# Altium project Coffee_printer.PrjPcb (part 1 of 2)
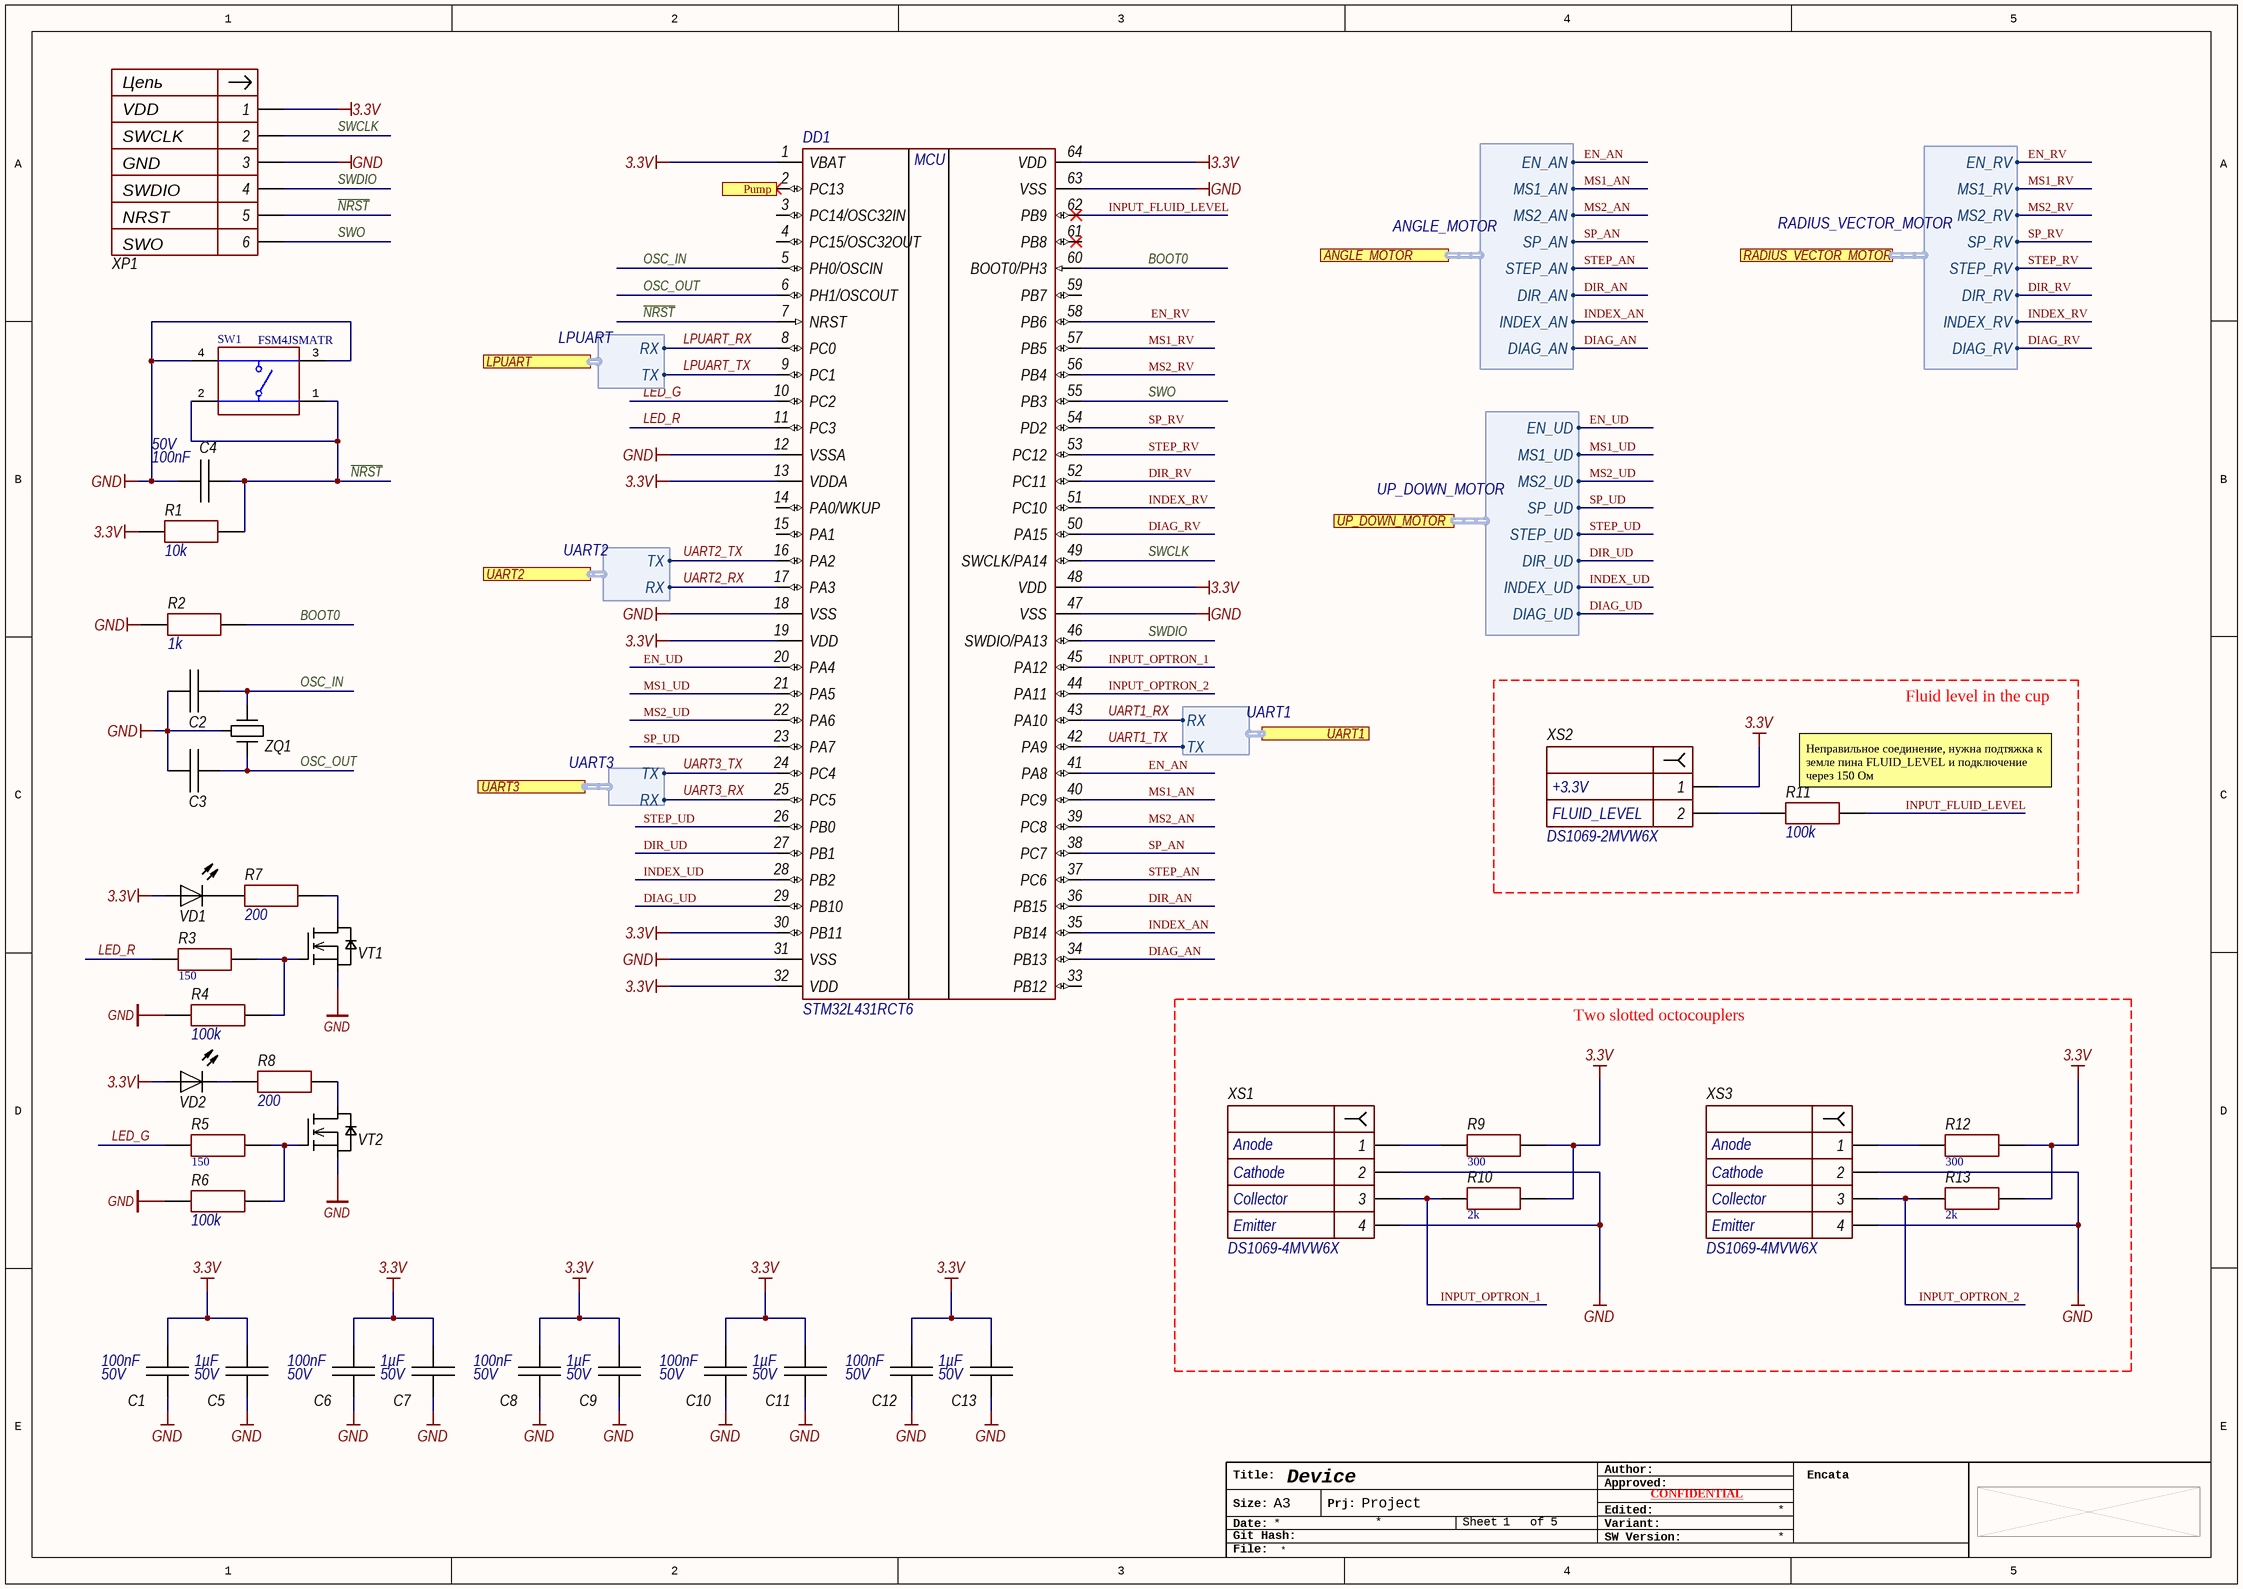
[diagram p0: Coffee_printer MCU.SchDoc]
Organization: Encata; ProjectNumber: 000654321; Title: Device; Title2str: Project
5 sheets, 88 parts. Net scope: flat (ports and power ports of the same name join across sheets).
Board file: Coffee_printer PCB.PcbDoc
Sheets:
  Coffee_printer MCU.SchDoc
  Coffee_printer PWR.SchDoc
  USB-UART.SchDoc
  Drivers_TMC2209.SchDoc
  Pump.SchDoc

## Sheet Coffee_printer MCU.SchDoc: Device
size 420 x 297 mm; SheetNumber: 1; SheetTotal: 5; ProjectTitle: Prj name

### Parts
C1  Capacitance: 100nF  Voltage Rating: 50V  [CAPC0603_H0.90_N]  (hidden comment: CC0603KRX7R7BB104)
C2  18  [CAPC0603_H0.85_N]  (value not drawn)
C3  18  [CAPC0603_H0.85_N]  (value not drawn)
C4  Capacitance: 100nF  Voltage Rating: 50V  [CAPC0603_H0.90_N]  (hidden comment: CC0603KRX7R7BB104)
C5  Voltage Rating: 50V  Capacitance: 1µF  [CAPC0603_H0.90_N]  (hidden comment: CC0603KRX7R7BB105)
C6  Capacitance: 100nF  Voltage Rating: 50V  [CAPC0603_H0.90_N]  (hidden comment: CC0603KRX7R7BB104)
C7  Voltage Rating: 50V  Capacitance: 1µF  [CAPC0603_H0.90_N]  (hidden comment: CC0603KRX7R7BB105)
C8  Capacitance: 100nF  Voltage Rating: 50V  [CAPC0603_H0.90_N]  (hidden comment: CC0603KRX7R7BB104)
C9  Voltage Rating: 50V  Capacitance: 1µF  [CAPC0603_H0.90_N]  (hidden comment: CC0603KRX7R7BB105)
C10  Capacitance: 100nF  Voltage Rating: 50V  [CAPC0603_H0.90_N]  (hidden comment: CC0603KRX7R7BB104)
C11  Voltage Rating: 50V  Capacitance: 1µF  [CAPC0603_H0.90_N]  (hidden comment: CC0603KRX7R7BB105)
C12  Capacitance: 100nF  Voltage Rating: 50V  [CAPC0603_H0.90_N]  (hidden comment: CC0603KRX7R7BB104)
C13  Voltage Rating: 50V  Capacitance: 1µF  [CAPC0603_H0.90_N]  (hidden comment: CC0603KRX7R7BB105)
DD1  STM32L431RCT6  [LQFP-64]
R1  Resistance: 10k  [RESC0603_N]  (hidden comment: RC0603FR-0710KL)
R2  Resistance: 1k  [RESC0603_N]  (hidden comment: RC0603FR-071KL)
R3  Resistance: 150  [RESC0603_N]  (hidden comment: RC0603FR-07150RL)
R4  Resistance: 100k  [RESC0603_N]  (hidden comment: RC0603FR-07100KL)
R5  Resistance: 150  [RESC0603_N]  (hidden comment: RC0603FR-07150RL)
R6  Resistance: 100k  [RESC0603_N]  (hidden comment: RC0603FR-07100KL)
R7  Resistance: 200  [RESC0603_N]  (hidden comment: RC0603FR-07200RL)
R8  Resistance: 200  [RESC0603_N]  (hidden comment: RC0603FR-07200RL)
R9  Resistance: 300  [RESC0603_N]  (hidden comment: RC0603FR-07300RL)
R10  Resistance: 2k  [RESC0603_N]  (hidden comment: RC0603FR-072KL)
R11  Resistance: 100k  [RESC0603_N]  (hidden comment: RC0603FR-07100KL)
R12  Resistance: 300  [RESC0603_N]  (hidden comment: RC0603FR-07300RL)
R13  Resistance: 2k  [RESC0603_N]  (hidden comment: RC0603FR-072KL)
SW1  FSM4JSMATR  [TECO-FSM4JSMATR_V]
VD1  FYLS-0603URC  [CH0603LR]  (value not drawn)
VD2  FYLS-0603UGC  [CH0603LG]  (value not drawn)
VT1  MMBF170LT1G  [SOT-23-3]  (value not drawn)
VT2  MMBF170LT1G  [SOT-23-3]  (value not drawn)
XP1  STM32_6pin_SWD  [PLS-6(DS-1021-1x6)]  (value not drawn)
XS1  DS1069-4MVW6X  NET4: Emitter  NET3: Collector  NET2: Cathode  NET1: Anode  [CWF-4]
XS2  DS1069-2MVW6X  NET2: FLUID_LEVEL  NET1: +3.3V  [CWF-2]
XS3  DS1069-4MVW6X  NET4: Emitter  NET3: Collector  NET2: Cathode  NET1: Anode  [CWF-4]
ZQ1  ABM3B-8.000MHZ-B2-T  [ZQ_ABM3B-B2-T]  (value not drawn)

### Blocks framed on the sheet
Fluid level in the cup: R11 XS2
Two slotted octocouplers: R9 R10 R12 R13 XS1 XS3

### Ports
ANGLE_MOTOR (harness ANGLE_MOTOR), LPUART (harness LPUART), Pump (in), RADIUS_VECTOR_MOTOR (harness RADIUS_VECTOR_MOTOR), UART1 (harness UART1), UART2 (harness UART2), UART3 (harness UART3), UP_DOWN_MOTOR (harness UP_DOWN_MOTOR)

### Harnesses
UART2: RX, TX
UART1: RX, TX
UART3: RX, TX
LPUART: TX, RX
ANGLE_MOTOR: MS1_AN, EN_AN, MS2_AN, SP_AN, STEP_AN, DIR_AN, INDEX_AN, DIAG_AN
RADIUS_VECTOR_MOTOR: MS1_RV, EN_RV, MS2_RV, SP_RV, STEP_RV, DIR_RV, INDEX_RV, DIAG_RV
UP_DOWN_MOTOR: MS1_UD, EN_UD, MS2_UD, SP_UD, STEP_UD, DIR_UD, INDEX_UD, DIAG_UD

### Nets
3.3V: C1.1 C5.1 C6.1 C7.1 C8.1 C9.1 C10.1 C11.1 C12.1 C13.1 DD1.1(VBAT) DD1.13(VDDA) DD1.19(VDD) DD1.30(PB11) DD1.32(VDD) DD1.48(VDD) DD1.64(VDD) R1.1 R9.2 R10.2 R12.2 R13.2 VD1.1 VD2.1 XP1.1 XS2.1
GND: C1.2 C2.1 C3.1 C4.1 C5.2 C6.2 C7.2 C8.2 C9.2 C10.2 C11.2 C12.2 C13.2 DD1.12(VSSA) DD1.18(VSS) DD1.31(VSS) DD1.47(VSS) DD1.63(VSS) R2.1 R4.1 R6.2 SW1.3 SW1.4 VT1.2(S) VT2.2(S) XP1.3 XS1.2 XS1.4 XS3.2 XS3.4 ZQ1.2
BOOT0: DD1.60(BOOT0/PH3) R2.2
DIAG_AN: DD1.34(PB13) ; port ANGLE_MOTOR.DIAG_AN
DIAG_RV: DD1.50(PA15) ; port RADIUS_VECTOR_MOTOR.DIAG_RV
DIAG_UD: DD1.29(PB10) ; port UP_DOWN_MOTOR.DIAG_UD
DIR_AN: DD1.36(PB15) ; port ANGLE_MOTOR.DIR_AN
DIR_RV: DD1.52(PC11) ; port RADIUS_VECTOR_MOTOR.DIR_RV
DIR_UD: DD1.27(PB1) ; port UP_DOWN_MOTOR.DIR_UD
EN_AN: DD1.41(PA8) ; port ANGLE_MOTOR.EN_AN
EN_RV: DD1.58(PB6) ; port RADIUS_VECTOR_MOTOR.EN_RV
EN_UD: DD1.20(PA4) ; port UP_DOWN_MOTOR.EN_UD
INDEX_AN: DD1.35(PB14) ; port ANGLE_MOTOR.INDEX_AN
INDEX_RV: DD1.51(PC10) ; port RADIUS_VECTOR_MOTOR.INDEX_RV
INDEX_UD: DD1.28(PB2) ; port UP_DOWN_MOTOR.INDEX_UD
INPUT_FLUID_LEVEL: DD1.62(PB9) R11.1
INPUT_OPTRON_1: DD1.45(PA12) R10.1 XS1.3
INPUT_OPTRON_2: DD1.44(PA11) R13.1 XS3.3
LED_G: DD1.10(PC2) R5.1
LED_R: DD1.11(PC3) R3.1
LPUART_RX: DD1.8(PC0) ; port LPUART.RX
LPUART_TX: DD1.9(PC1) ; port LPUART.TX
MS1_AN: DD1.40(PC9) ; port ANGLE_MOTOR.MS1_AN
MS1_RV: DD1.57(PB5) ; port RADIUS_VECTOR_MOTOR.MS1_RV
MS1_UD: DD1.21(PA5) ; port UP_DOWN_MOTOR.MS1_UD
MS2_AN: DD1.39(PC8) ; port ANGLE_MOTOR.MS2_AN
MS2_RV: DD1.56(PB4) ; port RADIUS_VECTOR_MOTOR.MS2_RV
MS2_UD: DD1.22(PA6) ; port UP_DOWN_MOTOR.MS2_UD
~{NRST}: C4.2 DD1.7(NRST) R1.2 SW1.1 SW1.2 XP1.5
OSC_IN: C2.2 DD1.5(PH0/OSCIN) ZQ1.1
OSC_OUT: C3.2 DD1.6(PH1/OSCOUT) ZQ1.3
SP_AN: DD1.38(PC7) ; port ANGLE_MOTOR.SP_AN
SP_RV: DD1.54(PD2) ; port RADIUS_VECTOR_MOTOR.SP_RV
SP_UD: DD1.23(PA7) ; port UP_DOWN_MOTOR.SP_UD
STEP_AN: DD1.37(PC6) ; port ANGLE_MOTOR.STEP_AN
STEP_RV: DD1.53(PC12) ; port RADIUS_VECTOR_MOTOR.STEP_RV
STEP_UD: DD1.26(PB0) ; port UP_DOWN_MOTOR.STEP_UD
SWCLK: DD1.49(SWCLK/PA14) XP1.2
SWDIO: DD1.46(SWDIO/PA13) XP1.4
SWO: DD1.55(PB3) XP1.6
UART1_RX: DD1.43(PA10) ; port UART1.RX
UART1_TX: DD1.42(PA9) ; port UART1.TX
UART2_RX: DD1.17(PA3) ; port UART2.RX
UART2_TX: DD1.16(PA2) ; port UART2.TX
UART3_RX: DD1.25(PC5) ; port UART3.RX
UART3_TX: DD1.24(PC4) ; port UART3.TX
NetDD1_2: DD1.2(PC13) ; port Pump
NetR3_2: R3.2 R4.2 VT1.1(G)
NetR5_2: R5.2 R6.1 VT2.1(G)
NetR7_1: R7.1 VD1.2
NetR7_2: R7.2 VT1.3(D)
NetR8_1: R8.1 VD2.2
NetR8_2: R8.2 VT2.3(D)
NetR9_1: R9.1 XS1.1
NetR11_2: R11.2 XS2.2
NetR12_1: R12.1 XS3.1

Not connected (* = marked no-connect by the designer): DD1 3(PC14/OSC32IN) 4(PC15/OSC32OUT) 14(PA0/WKUP) 15(PA1) 33(PB12) 59(PB7) 61(PB8)

### Notes on the sheet
- (near R11) Неправильное соединение, нужна подтяжка к земле пина FLUID_LEVEL и подключение через 150 Ом
- Title:
- Author:
- Approved:
- Size:
- Date:
- Git Hash:
- A3
- Prj:
- Sheet
- of
- SW Version:
- Variant:
- Edited:
- CONFIDENTIAL
- File:
- (in symbol CMP-CON-B2B-0103-4) Цепь; VDD; SWCLK; GND; SWDIO; NRST; SWO
- (in symbol CMP-IC-EMBEDDED-MCU-0000-3) MCU

### Library data of the parts
C1 C4 C6 C8 C10 C12 = CMP-CAP-CER-SMD-0036-1: 0.1uF 10% X7R 50V 0603; Manufacturer: Yageo; Length: 1.6mm; Min Operating Temperature: -55°C; Case Code (Metric): 1608; Case Code (Imperial): 0603; Author: v.ivanchenko; Tolerance: 10%; Case/Package: 0603; Depth: 800µm; Manufacturer Part Number: CC0603KRX7R7BB104; HelpURL: https://www.yageo.com/upload/media/product/products/datasheet/mlcc/UPY-GPHC_X7R_6.3V-to-50V_20.pdf; Max Operating Temperature: 125°C; Lead Free: Lead Free; Height: 800µm; Dielectric: X7R; Series: CC
C2 C3 = CC0603FRNPO9BN180_Yageo: CAPC 18PF 50V C0G/NPO SMD 0603; Manufacturer: Yageo; Tolerance: ± 5 %; Voltage: 50 В; TKE: C0G; ValueBOM: Конденсатор CC0603FRNPO9BN180 "Yageo" (18 пФ ± 5 %, 50 В, C0G, SMD 0603); Автор: Жегалов Сергей; Количество1: 1; Цена1: 0.0348; Количество2: 4000; Цена2: 0.0268; Разрешен к применению: True; Type_BOM: Конденсатор; PartNumber: CC0603FRNPO9BN180_Yageo; HelpURL: http://www.yageo.com/documents/recent/UPY-GP_NP0_16V-to-50V_16.pdf; ManufacturerPartNumber: CC0603FRNPO9BN180; ComponentLink3Description: Datasheet; Value: 18; ComponentLink2Description: Manufacturer Link; ComponentLink2URL: http://www.yageo.com/; Operating Temperature: -55°C ~ +125°C; Modify: 15.11.2018 9:22:46; Supplier: Compel; Supplier P/N: CC0603FRNPO9BN180; Sorting: 18; Package Description: SMD 0603 H0.85mm; ComponentLink4URL: https://sds.compel.ru/search?q=CC0603FRNPO9BN180; ComponentLink5URL: https://www.chipdip.by/search?searchtext=CC0603FRNPO9BN180; ComponentLink6URL: https://belchip.by/search_fuzzy/?query=CC0603FRNPO9BN180; ComponentLink4Description: Compel; ComponentLink5Description: Chip-Dip; ComponentLink6Description: Belchip; Package: CAPC0603; Package_BOM: SMD 0603
C5 C7 C9 C11 C13 = CMP-CAP-CER-SMD-0035-1: 1uF 10% X7R 50V 0603; Manufacturer: Yageo; HelpURL: https://www.yageo.com/upload/media/product/products/datasheet/mlcc/UPY-GPHC_X7R_6.3V-to-50V_20.pdf; Series: CC; Min Operating Temperature: -55°C; Tolerance: 10%; Case Code (Imperial): 0603; Manufacturer Part Number: CC0603KRX7R7BB105; Max Operating Temperature: 125°C; Case/Package: 0603; Depth: 800µm; Length: 1.6mm; Height: 800µm; Case Code (Metric): 1608; Lead Free: Lead Free; Dielectric: X7R; Author: v.ivanchenko
DD1 = CMP-IC-EMBEDDED-MCU-0000-3: MCU 32-Bit STM32 ARM Cortex M4 RISC 256KB Flash 1.8V/2.5V/3.3V 64-Pin LQFP; Manufacturer: ST; Core Architecture: ARM Cortex-M4; Number of Timers/Counters: 1; Number of ADC Channels: 16; Number of D/A Converters: 2; RAM Size: 64; Frequency: 80MHz; Min Supply Voltage: 1.62V; Number of UART Channels: 4; Interface: CAN, I2C, IrDA, LIN, SPI, USART; Max Supply Voltage: 3.6V; Number of USART Channels: 3; Number of PWM Channels: 11; Number of I/Os: 52; Manufacturer Part Number: STM32L431RCT6; Author: a.antipov; Case/Package: LQFP-64; Min Operating Temperature: -40°C; Number of A/D Converters: 1; Number of Pins: 64; Mount: Surface mount; Max Operating Temperature: 85°C; HelpUrl: https://www.st.com/resource/en/datasheet/stm32l431rc.pdf; Number of I2C Channels: 3; Number of SPI Channels: 3; Flash Memory Size: 256kB
R1 = CMP-RES-SMD-0437-2: RES SMD 10 KOHM 1% 1/10W 0603; Manufacturer: Yageo; Max Power Dissipation: 100mW; Temperature Coefficient: ±100ppm/C°; Voltage Rating: 75V; Author: M.S. Koval; Case/Package: 0603; HelpURL: https://www.yageo.com/upload/media/product/productsearch/datasheet/rchip/PYu-RC_Group_51_RoHS_L_11.pdf; Manufacturer Part Number: RC0603FR-0710KL; Max Operating Temperature: 155°C; Min Operating Temperature: -55°C; Tolerance: 1%
R2 = CMP-RES-SMD-0413-2: RES SMD 1 KOHM 1% 1/10W 0603; Manufacturer: Yageo; Max Power Dissipation: 100mW; Temperature Coefficient: ±100ppm/C°; Voltage Rating: 75V; Author: M.S. Koval; Case/Package: 0603; HelpURL: https://www.yageo.com/upload/media/product/productsearch/datasheet/rchip/PYu-RC_Group_51_RoHS_L_11.pdf; Manufacturer Part Number: RC0603FR-071KL; Max Operating Temperature: 155°C; Min Operating Temperature: -55°C; Tolerance: 1%
R3 R5 = CMP-RES-SMD-0393-5: RES SMD 150 OHM 1% 1/10W 0603; Manufacturer: Yageo; Max Power Dissipation: 100mW; Temperature Coefficient: ±100ppm/C°; Voltage Rating: 75V; Author: M.S. Koval; Case/Package: 0603; HelpURL: https://www.yageo.com/upload/media/product/productsearch/datasheet/rchip/PYu-RC_Group_51_RoHS_L_11.pdf; Manufacturer Part Number: RC0603FR-07150RL; Max Operating Temperature: 155°C; Min Operating Temperature: -55°C; Tolerance: 1%
R4 R6 R11 = CMP-RES-SMD-0462-2: RES SMD 100 KOHM 1% 1/10W 0603; Manufacturer: Yageo; Max Power Dissipation: 100mW; Temperature Coefficient: ±100ppm/C°; Voltage Rating: 75V; Author: M.S. Koval; Case/Package: 0603; HelpURL: https://www.yageo.com/upload/media/product/productsearch/datasheet/rchip/PYu-RC_Group_51_RoHS_L_11.pdf; Manufacturer Part Number: RC0603FR-07100KL; Max Operating Temperature: 155°C; Min Operating Temperature: -55°C; Tolerance: 1%
R7 R8 = CMP-RES-SMD-0396-2: RES SMD 200 OHM 1% 1/10W 0603; Manufacturer: Yageo; Max Power Dissipation: 100mW; Temperature Coefficient: ±100ppm/C°; Voltage Rating: 75V; Author: M.S. Koval; Case/Package: 0603; HelpURL: https://www.yageo.com/upload/media/product/productsearch/datasheet/rchip/PYu-RC_Group_51_RoHS_L_11.pdf; Manufacturer Part Number: RC0603FR-07200RL; Max Operating Temperature: 155°C; Min Operating Temperature: -55°C; Tolerance: 1%
R9 R12 = CMP-RES-SMD-0400-5: RES SMD 300 OHM 1% 1/10W 0603; Manufacturer: Yageo; Voltage Rating: 75V; Temperature Coefficient: ±100ppm/C°; Max Power Dissipation: 100mW; Max Operating Temperature: 155°C; Tolerance: 1%; HelpURL: https://www.yageo.com/upload/media/product/productsearch/datasheet/rchip/PYu-RC_Group_51_RoHS_L_11.pdf; Min Operating Temperature: -55°C; Case/Package: 0603; Author: M.S. Koval; Manufacturer Part Number: RC0603FR-07300RL
R10 R13 = CMP-RES-SMD-0420-5: RES SMD 2 KOHM 1% 1/10W 0603; Manufacturer: Yageo; Max Power Dissipation: 100mW; Temperature Coefficient: ±100ppm/C°; Voltage Rating: 75V; Author: M.S. Koval; Case/Package: 0603; HelpURL: https://www.yageo.com/upload/media/product/productsearch/datasheet/rchip/PYu-RC_Group_51_RoHS_L_11.pdf; Manufacturer Part Number: RC0603FR-072KL; Max Operating Temperature: 155°C; Min Operating Temperature: -55°C; Tolerance: 1%
SW1 = CMP-2000-07486-1: Micro Miniature Push Button Switch FSM JSM, 50 mA, -35 to 85 degC, 4-Pin SMD, RoHS, Tape and Reel; Manufacturer: TE Connectivity; Mechanical Life: 100000Cycles; Current Rating: 50mA; Actuator Material: Polyamide; Max Voltage Rating (DC): 12V; Capacitance: 0f; Illumination Type: Illuminated; Voltage Rating (DC): 24V; Case\/Package: SMD/SMT; Operating Force: 160gf; Contact Resistance: 100mOhm; Actuator Length: 0.055inch; Switch Travel: 0.25mm; Throw Configuration: SPST; Termination: GullWing; Contact Plating: Silver; Orientation: Straight; Mounting Technology: SurfaceMount; REACH SVHC: Unknown; Electrical Life: 100000Cycles; Package Reference: FSM4JSMATR; Max Operating Temperature: 85degC; Manufacturer URL: http://www.te.com/; Package Description: 4-Pin Surface Mount Device, Body 6 x 6 mm, Pitch 4.5 mm; Datasheet Version: Rev. V, 02/2015; Packaging: TapeandReel; Min Operating Temperature: -35degC; Mount: SurfaceMount; Contact Current Rating: 50mA; Contact Material: CopperAlloy; Package Quantity: 1200; Datasheet URL: http://www.te.com/commerce/DocumentDelivery/DDEController?Action=showdoc&DocId=Customer+Drawing%7F2-1437565-7%7FV%7Fpdf%7FEnglish%7FENG_CD_2-1437565-7_V.pdf%7F4-1437565-2; RoHSCompliant: true
VD1 = FYLS-0603URC_Foryard Optoelectronics: VD FYLS-0603URC LED RED 20mA 2,1V SMD 0603; ValueBOM: Диод FYLS-0603URC "Foryard Optoelectronics" CH0603; Voltage: 2,1 В; Автор: Коваль Максим; Количество1: 1; Цена1: 0.0450; Количество2: 16000; Цена2: 0.0306; Разрешен к применению: True; ВП: Диод FYLS-0603URC CH0603; Package_BOM: CH0603; Type_BOM: Диод; PartNumber: FYLS-0603URC_Foryard Optoelectronics; HelpURL: http://www.foryard-led.ru/pdf/fyls-0603urc.pdf; ManufacturerPartNumber: FYLS-0603URC; Manufacturer: Foryard Optoelectronics; ComponentLink3Description: Datasheet; Value: FYLS-0603URC; ComponentLink2Description: Manufacturer Link; ComponentLink2URL: http://foryard.com; Operating Temperature: -40°C ~ +85°C; Modify: 14.01.2019 13:57:40; Supplier: Compel; Supplier P/N: FYLS-0603URC; Package Description: LED 0603 RED; ComponentLink4URL: https://sds.compel.ru/search?q=FYLS-0603URC; ComponentLink5URL: https://www.chipdip.by/search?searchtext=FYLS-0603URC; ComponentLink6URL: https://belchip.by/search_fuzzy/?query=FYLS-0603URC; ComponentLink4Description: Compel; ComponentLink5Description: Chip-Dip; ComponentLink6Description: Belchip
VD2 = FYLS-0603UGC_Foryard Optoelectronics: VD FYLS-0603UGC LED GREEN 20mA 2V SMD 0603; ValueBOM: Диод FYLS-0603UGC "Foryard Optoelectronics" CH0603; Voltage: 2 В; Автор: Коваль Максим; Количество1: 1; Цена1: 0.0450; Количество2: 16000; Цена2: 0.0306; Разрешен к применению: True; ВП: Диод FYLS-0603UGC CH0603; Package_BOM: CH0603; Type_BOM: Диод; PartNumber: FYLS-0603UGC_Foryard Optoelectronics; HelpURL: http://www.foryard-led.ru/pdf/fyls-0603ugc.pdf; ManufacturerPartNumber: FYLS-0603UGC; Manufacturer: Foryard Optoelectronics; ComponentLink3Description: Datasheet; Value: FYLS-0603UGC; ComponentLink2Description: Manufacturer Link; ComponentLink2URL: http://foryard.com; Operating Temperature: -40°C ~ +85°C; Modify: 14.01.2019 13:57:40; Supplier: Compel; Supplier P/N: FYLS-0603UGC; Package Description: LED 0603 GREEN; ComponentLink4URL: https://sds.compel.ru/search?q=FYLS-0603UGC; ComponentLink5URL: https://www.chipdip.by/search?searchtext=FYLS-0603UGC; ComponentLink6URL: https://belchip.by/search_fuzzy/?query=FYLS-0603UGC; ComponentLink4Description: Compel; ComponentLink5Description: Chip-Dip; ComponentLink6Description: Belchip
VT1 VT2 = CMP-DISCRETE-TRANSISTORS-MOSFET0002-1: MMBF170L: Small Signal MOSFET 60V 500mA 5 Ohm Single N-Channel SOT-23 Logic Level; Manufacturer: ON Semiconductor; Type: N-ch; Power Dissipation: 225mW; Input Capacitance: 60pF; Theshold Voltage Vgth: 3V; Rds ON Max: 5; Gate to source voltage: 20V; Drain to Source Voltage Vds: 60V; Mount: Surface mount; Manufacturer Part Number: MMBF170LT1G; HelpUrl: https://www.onsemi.com/pdf/datasheet/mmbf170lt1-d.pdf; Continuous Drain Current ID: 500mA; Author: m.seliadtsou
XP1 = CMP-CON-B2B-0103-4: Manufacturer: FOXCONN; Manufacturer Part Number: HB3106F; Contact Current Rating: 2A; Gender: Male; Number of Contacts: 6; Pitch: 2.54mm; Voltage Rating: 60V; Author: v.taranau; Contact Gender: Male Headers; HelpURL: https://datasheet.lcsc.com/lcsc/2103291806_FOXCONN-HB3106F_C2761399.pdf; Mount: Through Hole
XS1 XS3 = CMP-CON-B2B-0011-2: 2.5mm, 4 pin, Male, 3A, Vertical mounting, CONNFLY; Gender: Female; Number of Contacts: 4; Voltage Rating: 250V; Author: a.antipov; Color: White; Contact Current Rating: 3A; Contact Gender: Male; Contact Plating: Tin; HelpURL: http://outer.connfly.group/static/upload/file/pdf/DS1069.pdf; Manufacturer: CONNFLY; Manufacturer Part Number: DS1069-4MVW6X; Mount: Through Hole; Orientation: Vertical; Pitch: 2.5mm
XS2 = CMP-CON-B2B-0007-3: 2.5mm, 2 pin, Male, 3A, Vertical mounting, CONNFLY; Gender: Female; Number of Contacts: 2; Voltage Rating: 250V; Author: a.antipov; Color: White; Contact Current Rating: 3A; Contact Gender: Male; Contact Plating: Tin; HelpURL: http://outer.connfly.group/static/upload/file/pdf/DS1069.pdf; Manufacturer: CONNFLY; Manufacturer Part Number: DS1069-2MVW6X; Mount: Through Hole; Orientation: Vertical; Pitch: 2.5mm
ZQ1 = ABM3B-8.000MHZ-B2-T_Abracon LLC: ZQ ABM3B-8.000MHZ-B2-T CERAMIC SMD CRYSTAL 8 MHz; ValueBOM: Кварцевый резонатор ABM3B-8.000MHZ-B2-T "Abracon LLC"; Автор: Касперович Андрей; Количество1: 1; Цена1: 0.4; Количество2: 10000; Цена2: 0.266; Разрешен к применению: True; ВП: Кварцевый резонатор ABM3B-8.000MHZ-B2-T; Type_BOM: Разное; HelpURL: https://ru.mouser.com/datasheet/2/3/abm3b-39910.pdf; PartNumber: ABM3B-8.000MHZ-B2-T_Abracon LLC; ManufacturerPartNumber: ABM3B-8.000MHZ-B2-T; Manufacturer: Abracon LLC; Value: ABM3B-8.000MHZ-B2-T; ComponentLink3Description: Datasheet; Modify: 16.11.2018 10:44:09; Supplier: Compel; Supplier P/N: ABM3B-8.000MHZ-B2-T; Package: ZQ_ABM3B-B2-T; ComponentLink4URL: https://sds.compel.ru/search?q=ABM3B-8.000MHZ-B2-T; ComponentLink5URL: https://www.chipdip.by/search?searchtext=ABM3B-8.000MHZ-B2-T; ComponentLink6URL: https://belchip.by/search_fuzzy/?query=ABM3B-8.000MHZ-B2-T; ComponentLink4Description: Compel; ComponentLink5Description: Chip-Dip; ComponentLink6Description: Belchip; Package_BOM: ZQ_ABM3B-B2-T; Package Description: ZQ_ABM3B-B2-T; SMD mounting: True; ComponentLink1Description: Supplier; ComponentLink1URL: http://www.compel.ru; ComponentLink2Description: Manufacturer Link; ComponentLink2URL: http://www.abracon.com; Type: XXX

## Sheet Coffee_printer PWR.SchDoc: Device
size 420 x 297 mm; SheetNumber: 2; SheetTotal: 5; ProjectTitle: Prj name
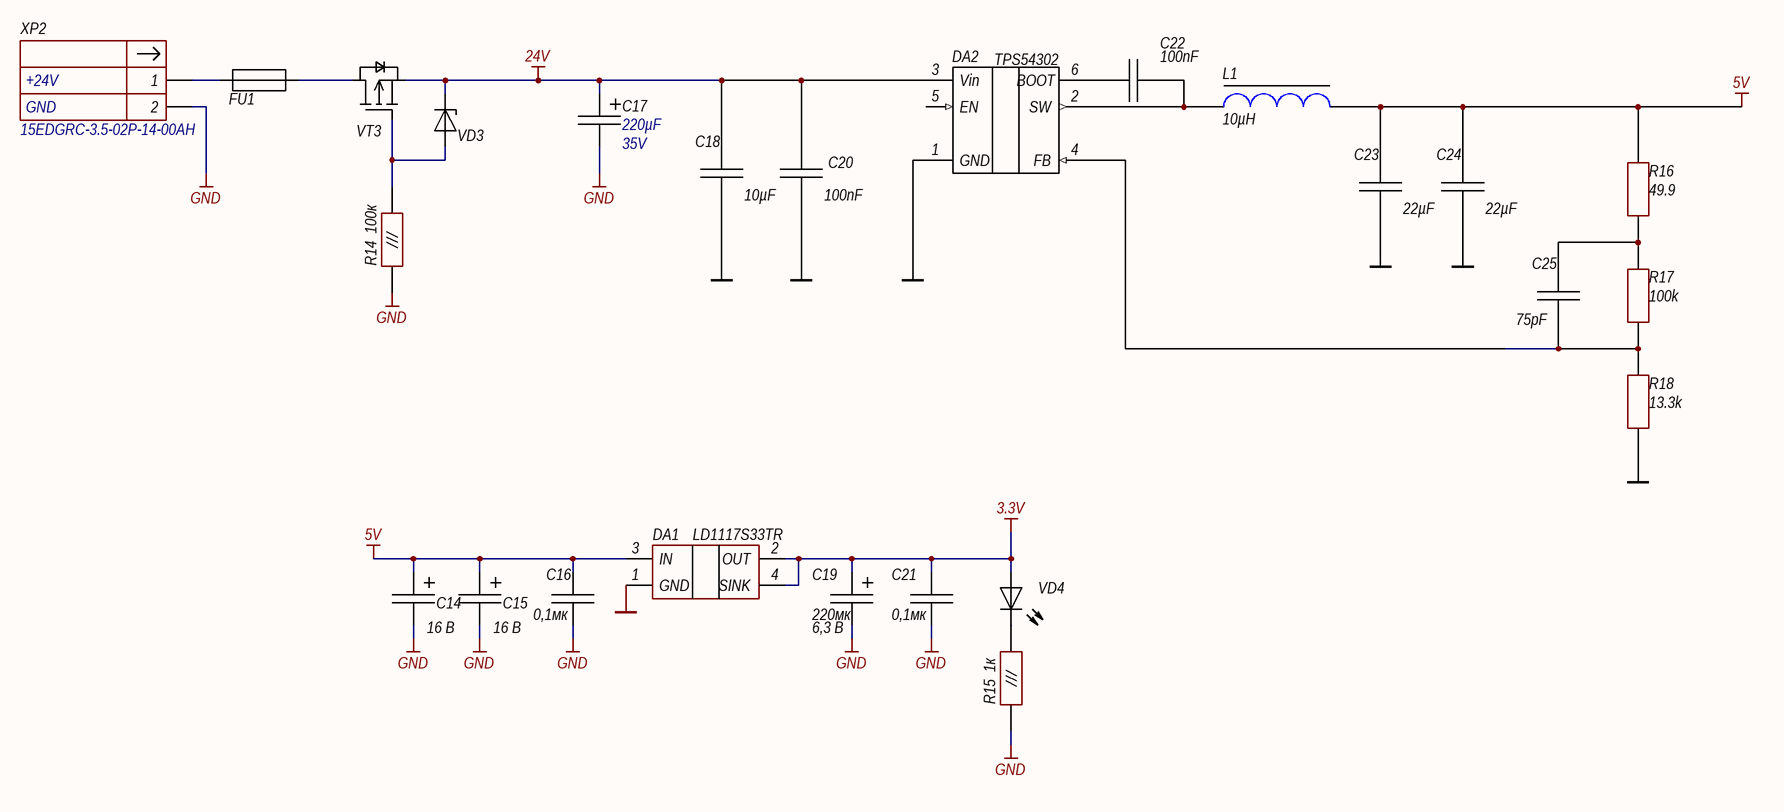
[diagram p1: Coffee_printer PWR.SchDoc]

### Parts
C14  voltage: 16 В  [CAPELSMD_D6.3_H5.5]  (hidden comment: 100мк)
C15  voltage: 16 В  [CAPELSMD_D6.3_H5.5]  (hidden comment: 100мк)
C16  0,1мк  [CAPC0805_H1.0_N]
C17  Capacitance: 220µF  Voltage Rating: 35V  [CAPELSMD_D8_H10.2]  (hidden comment: EEEFK1V221P)
C18  Capacitance: 10µF  [CAPC1210_H2.2_N]  (hidden comment: CL32B106KBJNFNE)
C19  220мк  voltage: 6,3 В  [CAPTAN_C_N]
C20  Capacitance: 100nF  [CAPC0603_H0.90_N]  (hidden comment: CC0603KRX7R7BB104)
C21  0,1мк  [CAPC0805_H1.0_N]
C22  Capacitance: 100nF  [CAPC0603_H0.90_N]  (hidden comment: CC0603KRX7R7BB104)
C23  Capacitance: 22µF  [CAPC1210_H2.2_N]  (hidden comment: CL32B226KAJNNNE)
C24  Capacitance: 22µF  [CAPC1210_H2.2_N]  (hidden comment: CL32B226KAJNNNE)
C25  Capacitance: 75pF  [CAPC0603_H0.90_N]  (hidden comment: CC0603JRNPO9BN750)
DA1  LD1117S33TR  [SOT-223]
DA2  TPS54302  [SOT-23-6]
FU1  0451001.MRL  [SMT_FUSE_451_453]  (value not drawn)
L1  Inductance: 10µH  [IHLP2525]  (hidden comment: IHLP2525CZER100M11)
R14  100к  [RESC0603_N]
R15  1к  [RESC0603_N]
R16  Resistance: 49.9  [RESC0603_N]  (hidden comment: RC0603FR-0749R9L)
R17  Resistance: 100k  [RESC0603_N]  (hidden comment: RC0603FR-07100KL)
R18  Resistance: 13.3k  [RESC0603_N]  (hidden comment: RC0603FR-0713K3L)
VD3  MMSZ12T1G  [SOD-123]  (value not drawn)
VD4  FYLS-0603UGC  [CH0603LG]  (value not drawn)
VT3  SI7617DN-T1-GE3  [PowerPAK 1212-8]  (value not drawn)
XP2  15EDGRC-3.5-02P-14-00AH  NET1: +24V  NET2: GND  [15EDGRC-3.5-02P-14-00AH]

### Nets
3.3V: C19.1 C21.1 DA1.2(OUT) DA1.4(SINK) VD4.1
5V: C14.1 C15.1 C16.1 C23.1 C24.1 DA1.3(IN) L1.2 R16.2
24V: C17.1 C18.1 C20.2 DA2.3(Vin) VD3.2 VT3.2(S)
GND: C14.2 C15.2 C16.2 C17.2 C18.2 C19.2 C20.1 C21.2 C23.2 C24.2 DA1.1(GND) DA2.1(GND) R14.1 R15.1 R18.1 XP2.2
NetC22_1: C22.1 DA2.6(BOOT)
NetC22_2: C22.2 DA2.2(SW) L1.1
NetC25_1: C25.1 R16.1 R17.2
NetC25_2: C25.2 DA2.4(FB) R17.1 R18.2
NetFU1_1: FU1.1 XP2.1
NetFU1_2: FU1.2 VT3.3(D)
NetR14_2: R14.2 VD3.1 VT3.1(G)
NetR15_2: R15.2 VD4.2

Not connected (* = marked no-connect by the designer): DA2 5(EN)

### Notes on the sheet
- Title:
- Author:
- Approved:
- Size:
- Date:
- Git Hash:
- A3
- Prj:
- Sheet
- of
- SW Version:
- Variant:
- Edited:
- CONFIDENTIAL
- File:

### Library data of the parts
C14 C15 = CA016M0100RED-0605_Yageo: CAP ALUM 100UF 20% 16V SMD; Manufacturer: Yageo; ValueBOM: Конденсатор CA016M0100RED-0605 "Yageo" (100 мкФ ± 20 %, 16 В SMD_D6.3_H5.5); Marking: 100 16V; Sorting: 100000000; Автор: Жегалов Сергей; Количество1: 1; Цена1: 0.0496; Количество2: 5000; Цена2: 0.0354; Разрешен к применению: True; Package_BOM: SMD_D6.3_H5.5; Type_BOM: Конденсатор; PartNumber: CA016M0100RED-0605_Yageo; HelpURL: http://www.yageo.com/documents/recent/E-Cap_SurfaceMount_CA_2011.pdf; ManufacturerPartNumber: CA016M0100RED-0605; ComponentLink3Description: Datasheet; Value: 100мк; Tolerance: ± 20 %; ComponentLink2Description: Manufacturer Link; ComponentLink2URL: http://www.yageo.com/; Operating Temperature: -40°C ~ +85°C; Modify: 19.11.2018 13:30:41; Supplier: Compel; Supplier P/N: CA016M0100RED-0605; Package Description: SMD D6.3mm, H5.5mm; ComponentLink4URL: https://sds.compel.ru/search?q=CA016M0100RED-0605; ComponentLink5URL: https://www.chipdip.by/search?searchtext=CA016M0100RED-0605; ComponentLink6URL: https://belchip.by/search_fuzzy/?query=CA016M0100RED-0605; ComponentLink4Description: Compel; ComponentLink5Description: Chip-Dip; ComponentLink6Description: Belchip; Package: CAPELSMD_D6.3_H5.5
C16 C21 = CC0805KPX7R9BB104_Yageo: CAPC 0.1uF 50V X7R SMD 0805; Manufacturer: Yageo; Tolerance: ± 10 %; Voltage: 50 В; ValueBOM: Конденсатор CC0805KPX7R9BB104 "Yageo" (0,1 мкФ ± 10 %, 50 В, X7R, SMD 0805); Modify: Чт, 15.11.2018 9:22:46; Sorting: 100000; Автор: Жегалов Сергей; Количество1: 1; Цена1: 0.0335; Количество2: 7800; Цена2: 0.0239; Разрешен к применению: True; Type_BOM: Конденсатор; PartNumber: CC0805KPX7R9BB104_Yageo; ManufacturerPartNumber: CC0805KPX7R9BB104; ComponentLink3Description: Datasheet; Value: 0,1мк; TKE: X7R; ComponentLink2Description: Manufacturer Link; ComponentLink2URL: http://www.yageo.com/; Operating Temperature: -55°C ~ +125°C; Supplier: Compel; Supplier P/N: CC0805KPX7R9BB104; Package Description: SMD 0805 H1.0mm; ComponentLink4URL: https://sds.compel.ru/search?q=CC0805KPX7R9BB104; ComponentLink5URL: https://www.chipdip.by/search?searchtext=CC0805KPX7R9BB104; ComponentLink6URL: https://belchip.by/search_fuzzy/?query=CC0805KPX7R9BB104; ComponentLink4Description: Compel; ComponentLink5Description: Chip-Dip; ComponentLink6Description: Belchip; Package: CAPC0805_H1.0; Package_BOM: SMD 0805; HelpURL: http://www.yageo.com/documents/recent/UPY-GPHC_X7R_6.3V-to-50V_18.pdf
C17 = CMP-CAP-EL-SMD-0047-1: 35V 220uF 105°C (8x10,2mm )2000Hours; Manufacturer: Panasonic; Dissipation Factor: 12%; ESR (Equivalent Series Resistance): 0.16; Leakage Current: 3µA; Ripple Current: 600mA; Tolerance: 20%; Author: M.S.Koval; Case/Package: Radial; Diameter: 8mm; Height: 10.2mm; HelpURL: https://b2b-api.panasonic.eu/file_stream/pids/fileversion/3127; Lead Free: Lead Free; Length: 10.2mm; Life (Hours): 2000Hour; Manufacturer Part Number: EEEFK1V221P; Max Operating Temperature: 105°C; Min Operating Temperature: -55°C; Series: FK
C18 = CMP-CAP-CER-SMD-0044-1: 10uF 10% X7R 50V 1210; Manufacturer: Samsung; Author: V.Kisel; Case Code (Imperial): 1210; Case Code (Metric): 3225; Case/Package: 1210; Dielectric: X7R; Height: 2.5mm; HelpURL: https://product.samsungsem.com/mlcc/CL32B106KBJNFN.do; Length: 3.2mm; Manufacturer Part Number: CL32B106KBJNFNE; Max Operating Temperature: 125°C; Min Operating Temperature: -55°C; Series: CL; Tolerance: 10%; Voltage Rating: 50V; Width: 2.5mm
C19 = 293D227X96R3C2TE3_Vishay Semiconductor: CAPTAN 220uF 10% 6.3V SMD_6032-28(size_C); ValueBOM: Конденсатор 293D227X96R3C2TE3 "Vishay Semiconductor" (220 мкФ ± 10 %, 6,3 В TANTAL_C); Modify: Ср, 21.11.2018 9:22:46; Sorting: 220000000; Автор: Жегалов Сергей; Количество1: 1; Цена1: 0.2982; Количество2: 2500; Цена2: 0.2024; Разрешен к применению: True; Package_BOM: TANTAL_C; Type_BOM: Конденсатор; PartNumber: 293D227X96R3C2TE3_Vishay Semiconductor; HelpURL: http://www.vishay.com/docs/40002/293d.pdf; Manufacturer: Vishay Semiconductor; ManufacturerPartNumber: 293D227X96R3C2TE3; ComponentLink3Description: Datasheet; Value: 220мк; Tolerance: ± 10 %; ComponentLink2Description: Manufacturer Link; ComponentLink2URL: http://www.vishay.com; Operating Temperature: -55°C ~ +125°C; Supplier: Compel; Supplier P/N: 293D227X96R3C2TE3; Package Description: TANTAL_C (6x3.2x2.5) code_6032-28; ComponentLink4URL: https://sds.compel.ru/search?q=293D227X96R3C2TE3; ComponentLink5URL: https://www.chipdip.by/search?searchtext=293D227X96R3C2TE3; ComponentLink6URL: https://belchip.by/search_fuzzy/?query=293D227X96R3C2TE3; ComponentLink4Description: Compel; ComponentLink5Description: Chip-Dip; ComponentLink6Description: Belchip; Package: CAPTAN_C
C20 C22 = CMP-CAP-CER-SMD-0036-2: 0.1uF 10% X7R 16V 0603; Manufacturer: Yageo; Length: 1.6mm; Min Operating Temperature: -55°C; Case Code (Metric): 1608; Case Code (Imperial): 0603; Author: v.ivanchenko; Tolerance: 10%; Case/Package: 0603; Depth: 800µm; Manufacturer Part Number: CC0603KRX7R7BB104; HelpURL: https://www.yageo.com/upload/media/product/products/datasheet/mlcc/UPY-GPHC_X7R_6.3V-to-50V_20.pdf; Max Operating Temperature: 125°C; Voltage Rating: 16V; Lead Free: Lead Free; Height: 800µm; Dielectric: X7R; Series: CC
C23 C24 = CMP-CAP-CER-SMD-0043-1: Ceramic capacitor SMD-1210 22000nF (22uF) /25V X7R# K +- 10% Samsung, RoHS/4k/; Dielectric: X7R; Voltage Rating: 25V; Author: V.Kisel; Case Code (Imperial): 1210; Case Code (Metric): 3225; Case/Package: 1210; Depth: 2.5mm; Height: 2.5mm; HelpURL: https://weblib.samsungsem.com/mlcc/mlcc-ec-data-sheet.do?partNumber=CL32B226KAJNNN; Lead Free: Lead Free; Length: 3.2mm; Manufacturer: Samsung; Manufacturer Part Number: CL32B226KAJNNNE; Max Operating Temperature: 125°C; Min Operating Temperature: -55°C; Series: CL; Tolerance: 10%; Width: 2.5mm
C25 = CMP-CAP-CER-SMD-0042-1: 0603 75 pF 50 V ±5 % Tolerance NP0 SMT Multilayer Ceramic Capacitor; Manufacturer: Yageo; Tolerance: 5%; Voltage Rating: 50V; Length: 1.6mm; Min Operating Temperature: -55°C; Case Code (Metric): 1608; Case Code (Imperial): 0603; Author: V.Kisel; Case/Package: 0603; Depth: 800µm; Manufacturer Part Number: CC0603JRNPO9BN750; HelpURL: https://www.yageo.com/upload/media/product/products/datasheet/mlcc/UPY-GPHC_X7R_6.3V-to-50V_20.pdf; Max Operating Temperature: 125°C; Width: 800µm; Lead Free: Lead Free; Height: 800µm; Dielectric: NP0; Series: CC
DA1 = LD1117S33TR_STMicroelectronics: DA LD1117S33TR REG LINEAR 3.3V 800MA SOT223; ValueBOM: Микросхема  LD1117S33TR "STMicroelectronics" SOT-223; Modify: Пн, 26.11.2018 11:39:06; Автор: Дёмин Виктор; Количество1: 1; Цена1: 0.16; Количество2: 5000; Цена2: 0.1; Разрешен к применению: True; SMD mounting: False; Type_BOM: Микросхема; PartNumber: LD1117S33TR_STMicroelectronics; HelpURL: http://www.st.com/content/ccc/resource/technical/document/datasheet/99/3b/7d/91/91/51/4b/be/CD00000544.pdf/files/CD00000544.pdf/jcr:content/translations/en.CD00000544.pdf; ManufacturerPartNumber: LD1117S33TR; Manufacturer: STMicroelectronics; ComponentLink4URL: https://sds.compel.ru/search?q=LD1117S33TR; ComponentLink5URL: https://www.chipdip.by/search?searchtext=LD1117S33TR; ComponentLink6URL: https://belchip.by/search_fuzzy/?query=LD1117S33TR; ComponentLink4Description: Compel; ComponentLink5Description: Chip-Dip; ComponentLink6Description: Belchip; ComponentLink3Description: Datasheet; Value: LD1117S33TR; ComponentLink2Description: Manufacturer Link; ComponentLink2URL: http://www.st.com; Supplier: Compel; Supplier P/N: LD1117S33TR; Package Description: SOT-223; Package: SOT-223; Package_BOM: SOT-223
DA2 = CMP-IC-POW_MGMT-SVR0002-1: 4.5-V to 28-V Input, 3-A Output, EMI Friendly Synchronous Step-Down Converter; Manufacturer: Texas Instruments; Max Input Voltage: 28V; Max Output Current: 3A; Min Input Voltage: 4.5V; Min Output Voltage: 600mV; Output Configuration: Positive; Output Type: Adjustable; Quiescent Current: 45µA; Switching Frequency: 400kHz; Synchronous Rectifier: Yes; Author: V.Kisel; HelpUrl: https://datasheet.lcsc.com/lcsc/1810181611_Texas-Instruments-TPS54302DDCT_C129370.pdf; Manufacturer Part Number: TPS54302; Max Operating Temperature: 125°C; Max Output Voltage: 28V; Min Operating Temperature: -40°C; Mount: Surface mount; Output Current: 3A
FU1 = 0451001.MRL_Littelfuse: FU_0451001.MRL 1A 125V FUSE SMT; Voltage: 125 В; ValueBOM: 0451001.MRL EIA RS-481-2; Автор: Касперович Андрей; Количество1: 1; Цена1: 0,279; Количество2: 1000; Разрешен к применению: True; Package_BOM: EIA RS-481-2; Type_BOM: Разное; HelpURL: https://www.littelfuse.com/~/media/electronics/datasheets/fuses/littelfuse_fuse_451_453_datasheet.pdf.pdf; PartNumber: 0451001.MRL_Littelfuse; ManufacturerPartNumber: 0451001.MRL; Manufacturer: Littelfuse; Value: 0451001.MRL; Current: 1A; Marking: 1A; ComponentLink3Description: Datasheet; Modify: 01.04.2019 11:07:42; Supplier: Compel; Supplier P/N: 0451001.MRL; Package: SMT6.1X2.7; Цена2: 0,279; ВП: 0451001.MRL EIA RS-481-2; ComponentLink4URL: https://sds.compel.ru/search?q=0451001.MRL; ComponentLink5URL: https://www.chipdip.by/search?searchtext=0451001.MRL; ComponentLink6URL: https://belchip.by/search_fuzzy/?query=0451001.MRL; ComponentLink4Description: Compel; ComponentLink5Description: Chip-Dip; ComponentLink6Description: Belchip; Package Description: Surface Mount Fuses / NANO2® > Very Fast-Acting > 451/453 Series; SMD mounting: True; ComponentLink1Description: Supplier; ComponentLink1URL: http://www.compel.ru; ComponentLink2Description: Manufacturer Link; ComponentLink2URL: http://www.littelfuse.com/; Type: XXX
L1 = CMP-IND-0020-1: SMD2525 10uH 4A/3.5A 50V 71.2 mOhm; Manufacturer: Vishay; DC Resistance (DCR): 71.2m; Max DC Current: 4A; Saturation Current: 3.5A; Self Resonant Frequency: 18MHz; Tolerance: 20%; Author: V.Kisel; Case/Package: 2525; Depth: 6.72mm; Height: 3mm; HelpURL: https://www.vishay.com/docs/34190/ihlp-2525cz-11.pdf; Lead Free: Yes; Length: 6.5mm; Manufacturer Part Number: IHLP2525CZER100M11; Max Operating Temperature: 125°C; Min Operating Temperature: -55°C; Mount: Surface Mount; RMS Current (Irms): 4A; RoHS Compliant: Yes; Series: IHLP; Width: 6.5mm
R14 = RC0603FR-07100KL_Yageo: RES 100K SMD 0603 1%; Manufacturer: Yageo; Power: 0,1 Вт; ValueBOM: Резистор RC0603FR-07100KL "Yageo" (100 кОм ± 1 %, 0,1 Вт SMD 0603); ТКС: ±100ppm/C°; Sorting: 100000; Автор: Анципов Антон; Количество1: 1; Цена1: 0; Количество2: 10000; Разрешен к применению: True; ВП: Резистор RC0603FR-07100KL (100 кОм ± 1 %, 0,1 Вт SMD 0603); Type_BOM: Резистор; HelpURL: http://yageo.ru/pdf/RC0603.pdf; PartNumber: RC0603FR-07100KL_Yageo; ManufacturerPartNumber: RC0603FR-07100KL; Value: 100к; Tolerance: ± 1 %; Operating Temperature: -55°C ~ +155°C; ComponentLink3Description: Datasheet; Modify: 22.10.2018 18:51:35; Supplier: Compel; Supplier P/N: RC0603FR-07100KL; Package: RESC0603; Цена2: 0; ComponentLink4URL: https://sds.compel.ru/search?q=RC0603FR-07100KL; ComponentLink5URL: https://www.chipdip.by/search?searchtext=RC0603FR-07100KL; ComponentLink6URL: https://belchip.by/search_fuzzy/?query=RC0603FR-07100KL; ComponentLink4Description: Compel; ComponentLink5Description: Chip-Dip; ComponentLink6Description: Belchip; Package_BOM: SMD 0603; Package Description: SMD 0603; SMD mounting: True; ComponentLink1Description: Supplier; ComponentLink1URL: http://www.compel.ru; ComponentLink2Description: Manufacturer Link; ComponentLink2URL: http://www.yageo.com/; Type: R
R15 = RC0603FR-071KL_Yageo: RES 1k SMD 0603 1%; Manufacturer: Yageo; Power: 0,1 Вт; ValueBOM: Резистор RC0603FR-071KL "Yageo" (1 кОм ± 1 %, 0,1 Вт SMD 0603); ТКС: ±100ppm/C°; Sorting: 1000; Автор: Анципов Антон; Количество1: 1; Цена1: 0; Количество2: 10000; Разрешен к применению: True; Type_BOM: Резистор; PartNumber: RC0603FR-071KL_Yageo; HelpURL: http://yageo.ru/pdf/RC0603.pdf; ManufacturerPartNumber: RC0603FR-071KL; ComponentLink3Description: Datasheet; Value: 1к; Tolerance: ± 1 %; ComponentLink2Description: Manufacturer Link; ComponentLink2URL: http://www.yageo.com/; Operating Temperature: -55°C ~ +155°C; Modify: 22.10.2018 18:51:35; Supplier: Compel; Supplier P/N: RC0603FR-071KL; Package Description: SMD 0603; Цена2: 0; Package: RESC0603; Type: R; ComponentLink4URL: https://sds.compel.ru/infosheet/YAG/RC0603FR-071KL; ComponentLink5URL: https://www.chipdip.by/catalog/smd-resistors?gq=RC0603FR-071KL; ComponentLink6URL: https://belchip.by/product/?selected_product=19295; ComponentLink4Description: Compel; ComponentLink5Description: Chip-Dip; ComponentLink6Description: Belchip; Package_BOM: SMD 0603
R16 = CMP-RES-SMD-0963-1: Res General Purpose Thick Film 0603 49.9 Ohm 1% 1/10W ±100ppm/°C Molded SMD Paper T/R; Manufacturer: Yageo; Max Power Dissipation: 100mW; Voltage Rating: 75V; Author: V.Kisel; Case/Package: 0603; Manufacturer Part Number: RC0603FR-0749R9L; Max Operating Temperature: 155°C; Min Operating Temperature: -55°C; Temperature Coefficient: 100ppm/°C; Tolerance: 1%
R17 = CMP-RES-SMD-0462-2: as R4 on sheet Coffee_printer MCU; Author: M.S. Koval; Case/Package: 0603; HelpURL: https://www.yageo.com/upload/media/product/productsearch/datasheet/rchip/PYu-RC_Group_51_RoHS_L_11.pdf; Manufacturer Part Number: RC0603FR-07100KL; Max Operating Temperature: 155°C; Min Operating Temperature: -55°C; Tolerance: 1%
R18 = CMP-RES-SMD-0441-2: RES SMD 13.3K OHM 1% 1/10W 0603; Manufacturer: Yageo; Max Power Dissipation: 100mW; Temperature Coefficient: 100ppm/°C; Voltage Rating: 75V; Author: M.S. Koval; Case/Package: 0603; HelpURL: https://www.yageo.com/upload/media/product/productsearch/datasheet/rchip/PYu-RC_Group_51_RoHS_L_11.pdf; Manufacturer Part Number: RC0603FR-0713K3L; Max Operating Temperature: 155°C; Min Operating Temperature: -55°C; Tolerance: 1%
VD3 = MMSZ12T1G_ON Semiconductor: Zener diode 500mW 12V  ±5% SOD-123; ValueBOM: Стабилитрон MMSZ12T1G "ON Semiconductor" SOD-123; Marking: СС4; Voltage: 12 В; Автор: Касперович Андрей; Количество1: 1; Цена1: 0.0183; Количество2: 10000; Цена2: 0.0131; Разрешен к применению: True; ВП: Стабилитрон MMSZ12T1G; Type_BOM: Диод; PartNumber: MMSZ12T1G_ON Semiconductor; HelpURL: https://www.onsemi.com/pub/Collateral/MMSZ5221ET1-D.PDF; ManufacturerPartNumber: MMSZ12T1G; Manufacturer: ON Semiconductor; ComponentLink3Description: Datasheet; Value: MMSZ12T1G; ComponentLink2Description: Manufacturer Link; ComponentLink2URL: http://www.onsemi.ru.com/; Operating Temperature: -65°C ~ +150°C; Modify: 01.04.2019 9:10:20; Supplier: Compel; Supplier P/N: MMSZ12T1G; Package Description: SOD-123; ComponentLink4URL: https://sds.compel.ru/search?q=MMSZ12T1G; ComponentLink5URL: https://www.chipdip.by/search?searchtext=MMSZ12T1G; ComponentLink6URL: https://belchip.by/search_fuzzy/?query=MMSZ12T1G; ComponentLink4Description: Compel; ComponentLink5Description: Chip-Dip; ComponentLink6Description: Belchip; Package_BOM: SOD-123
VD4 = FYLS-0603UGC_Foryard Optoelectronics: VD FYLS-0603UGC LED GREEN 20mA 2V SMD 0603; ValueBOM: Диод FYLS-0603UGC "Foryard Optoelectronics" CH0603; Modify: Пн, 14.01.2019 13:57:40; Voltage: 2 В; Автор: Коваль Максим; Количество1: 1; Цена1: 0.0450; Количество2: 16000; Цена2: 0.0306; Разрешен к применению: True; ВП: Диод FYLS-0603UGC CH0603; Package_BOM: CH0603; Type_BOM: Диод; PartNumber: FYLS-0603UGC_Foryard Optoelectronics; HelpURL: http://www.foryard-led.ru/pdf/fyls-0603ugc.pdf; ManufacturerPartNumber: FYLS-0603UGC; Manufacturer: Foryard Optoelectronics; ComponentLink3Description: Datasheet; Value: FYLS-0603UGC; ComponentLink2Description: Manufacturer Link; ComponentLink2URL: http://foryard.com; Operating Temperature: -40°C ~ +85°C; Supplier: Compel; Supplier P/N: FYLS-0603UGC; Package Description: LED 0603 GREEN; ComponentLink4URL: https://sds.compel.ru/search?q=FYLS-0603UGC; ComponentLink5URL: https://www.chipdip.by/search?searchtext=FYLS-0603UGC; ComponentLink6URL: https://belchip.by/search_fuzzy/?query=FYLS-0603UGC; ComponentLink4Description: Compel; ComponentLink5Description: Chip-Dip; ComponentLink6Description: Belchip
VT3 = CMP-DISCRETE-TRANSISTORS-MOSFET0007-1: MOSFET P-CH 30V 35A 1212-8 PPAK; Manufacturer Part Number: Si7615ADN; Manufacturer: Vishay; Power Dissipation: 3.7W; Rds ON Max: 4.4m; Drain to Source Voltage Vds: -30V; Continuous Drain Current ID: -35A; Theshold Voltage Vgth: -1.5V; Input Capacitance: 1.8nF; Gate to source voltage: 12V; Author: m.seliadtsou; Mount: Surface Mount; HelpUrl: https://www.vishay.com/docs/62667/si7615adn.pdf; Type: P-ch
XP2 = CMP-CON-TBLOCK-0010-3: 2 pin, 3.5mm, 8A, 250V; Manufacturer: Degson; Gender: Female; Number of Contacts: 2; Number of Levels: 1; Author: a.antipov; Color: Green; Contact Gender: Male; Contact Material: Brass, Tin; Contact Plating: Tin; Current Rating: 8A; HelpURL: http://files.клеммник.рф/pdf/15edgrc-3.5.pdf; Housing Color: Green; Housing Material: PA66, UL94V-0; Manufacturer Part Number: 15EDGRC-3.5-02P-14-00AH; Max Current Rating: 8A; Max Operating Temperature: 105°C; Min Operating Temperature: -40°C; Mount: Through Hole; Orientation: Horizontal; Pitch: 3.5mm; Series: 15EDGRC; Termination: Solder; Voltage Rating: 250V

## Sheet USB-UART.SchDoc: Device
size 420 x 297 mm; SheetNumber: 3; SheetTotal: 5; ProjectTitle: Prj name
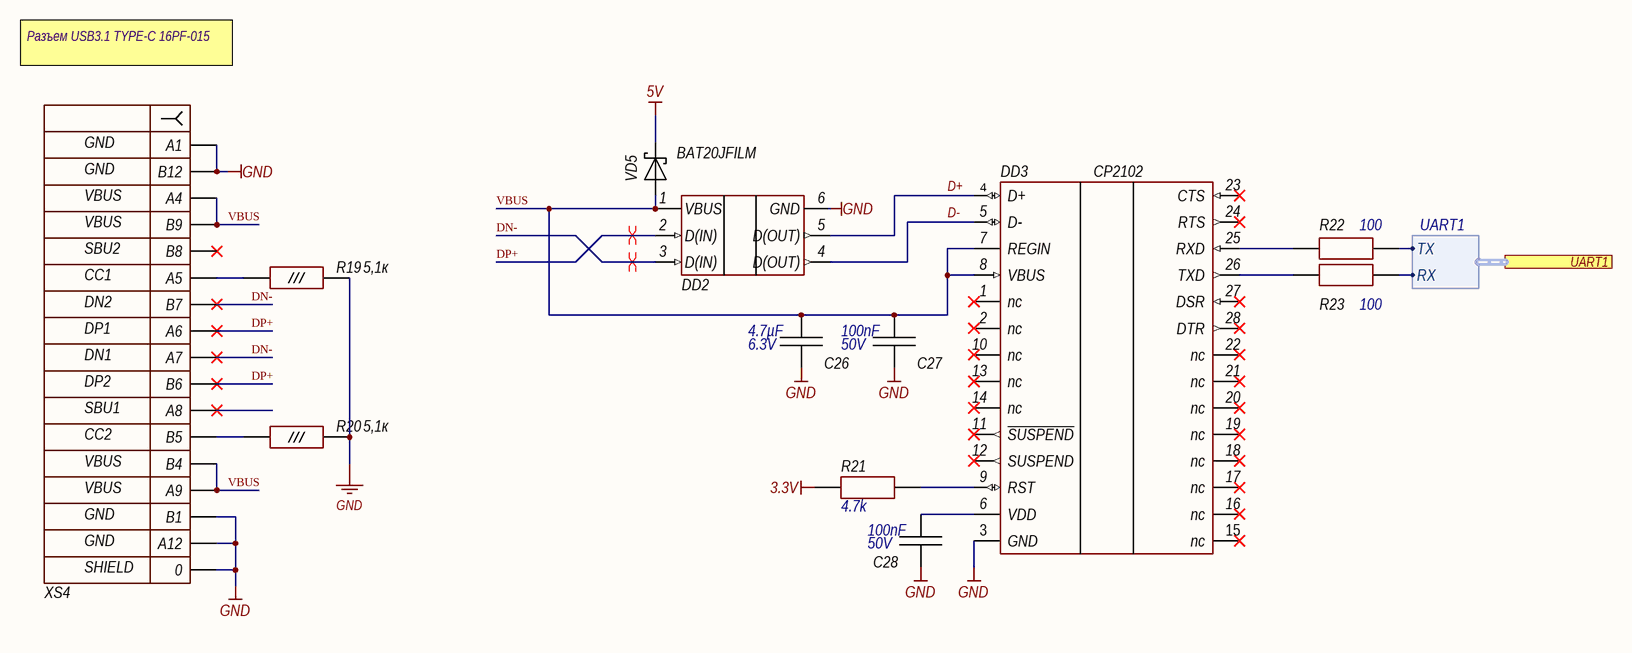
[diagram p2: USB-UART.SchDoc]

### Parts
C26  Voltage Rating: 6.3V  Capacitance: 4.7µF  [CAPC0603_H0.90_N]  (hidden comment: CC0603KRX7R5BB475)
C27  Capacitance: 100nF  Voltage Rating: 50V  [CAPC0603_H0.90_N]  (hidden comment: CC0603KRX7R7BB104)
C28  Capacitance: 100nF  Voltage Rating: 50V  [CAPC0603_H0.90_N]  (hidden comment: CC0603KRX7R7BB104)
DD2  STF202-22T1G  [TSOP-6]  (value not drawn)
DD3  CP2102  [QFN50P500X500X90_HS-29N]  (no BOM)
R19  5,1к  [RESC0402_N]
R20  5,1к  [RESC0402_N]
R21  Resistance: 4.7k  [RESC0603_N]  (hidden comment: RC0603FR-074K7L)
R22  Resistance: 100  [RESC0603_N]  (hidden comment: RC0603FR-07100RL)
R23  Resistance: 100  [RESC0603_N]  (hidden comment: RC0603FR-07100RL)
VD5  BAT20JFILM  [SOD-323]  (no BOM)
XS4  16pf-015  [XS_16PF-015]  (value not drawn)

### Ports
UART1 (harness UART1)

### Harnesses
UART1: RX, TX

### Nets
3.3V: R21.1
5V: VD5.2
GND: C26.2 C27.2 C28.2 DD2.6(GND) DD3.3(GND) R19.2 R20.2 XS4.0 XS4.1(A1) XS4.2(B12) XS4.15(B1) XS4.16(A12)
D+: DD2.5(D(OUT)) DD3.4(D+)
D-: DD2.4(D(OUT)) DD3.5(D-)
DN-: DD2.3(D(IN)) XS4.7(B7) XS4.9(A7)
DP+: DD2.2(D(IN)) XS4.8(A6) XS4.10(B6)
UART1_RX: R23.2 ; port UART1.RX
UART1_TX: R22.2 ; port UART1.TX
VBUS: C26.1 C27.1 DD2.1(VBUS) DD3.7(REGIN) DD3.8(VBUS) VD5.1 XS4.3(A4) XS4.4(B9) XS4.13(B4) XS4.14(A9)
NetC28_1: C28.1 DD3.6(VDD)
NetDD3_9: DD3.9(RST) R21.2
NetDD3_25: DD3.25(RXD) R22.1
NetDD3_26: DD3.26(TXD) R23.1
NetR19_1: R19.1 XS4.6(A5)
NetR20_1: R20.1 XS4.12(B5)

Not connected (* = marked no-connect by the designer): DD3 1(nc)* 2(nc)* 10(nc)* 11(~{SUSPEND})* 12(SUSPEND)* 13(nc)* 14(nc)* 15(nc)* 16(nc)* 17(nc)* 18(nc)* 19(nc)* 20(nc)* 21(nc)* 22(nc)* 23(CTS)* 24(RTS)* 27(DSR)* 28(DTR)*; XS4 5(B8)* 11(A8)*

### Layout directives
differential pair: DN-, DP+

### Notes on the sheet
- Разъем USB3.1 TYPE-C 16PF-015
- Title:
- Author:
- Approved:
- Size:
- Date:
- Git Hash:
- A3
- Prj:
- Sheet
- of
- SW Version:
- Variant:
- Edited:
- CONFIDENTIAL
- File:
- (in symbol CMP-CON-USB-0008-1) GND; VBUS; SBU2; CC1; DN2; DP1; DN1; DP2; SBU1; CC2; SHIELD

### Library data of the parts
C26 = CMP-CAP-CER-SMD-0033-1: 4.7uF 10% X7R 0603; Manufacturer: Yageo; Tolerance: 10%; Series: CC; Height: 800µm; Dielectric: X7R; Case Code (Metric): 1608; Length: 1.6mm; Case Code (Imperial): 0603; Max Operating Temperature: 125°C; Author: v.ivanchenko; Manufacturer Part Number: CC0603KRX7R5BB475; Min Operating Temperature: -55°C; Depth: 800µm; Lead Free: Lead Free; HelpURL: https://www.yageo.com/upload/media/product/products/datasheet/mlcc/UPY-GPHC_X7R_6.3V-to-50V_20.pdf; Case/Package: 0603
C27 C28 = CMP-CAP-CER-SMD-0036-1: as C1 on sheet Coffee_printer MCU; Length: 1.6mm; Min Operating Temperature: -55°C; Case Code (Metric): 1608; Case Code (Imperial): 0603; Author: v.ivanchenko; Tolerance: 10%; Case/Package: 0603; Depth: 800µm; Manufacturer Part Number: CC0603KRX7R7BB104; HelpURL: https://www.yageo.com/upload/media/product/products/datasheet/mlcc/UPY-GPHC_X7R_6.3V-to-50V_20.pdf; Max Operating Temperature: 125°C; Lead Free: Lead Free; Height: 800µm; Dielectric: X7R; Series: CC
DD2 = STF202-22T1G_ON Semiconductor: DD STF202-22T1G USB Filter with ESD protection; Voltage: 5,0 В; ValueBOM: Микросхема STF202-22T1G TSOP−6; Marking: S22; Автор: Коваль Максим; Количество1: 1; Цена1: 0.2926; Количество2: 2343; Цена2: 0.1986; Разрешен к применению: True; Type_BOM: Микросхема; HelpURL: https://www.onsemi.com/pub/Collateral/STF202-22T1-D.PDF; PartNumber: STF202-22T1G_ON Semiconductor; ManufacturerPartNumber: STF202-22T1G; Manufacturer: ON Semiconductor; Value: STF202-22T1G; ComponentLink3Description: Datasheet; Modify: 14.01.2019 15:51:31; Supplier: Compel; Supplier P/N: STF202-22T1G; Package: TSOP-6; ВП: Микросхема STF202-22T1G TSOP−6; ComponentLink4URL: https://sds.compel.ru/search?q=STF202-22T1G; ComponentLink5URL: https://www.chipdip.by/search?searchtext=STF202-22T1G; ComponentLink6URL: https://belchip.by/search_fuzzy/?query=STF202-22T1G; ComponentLink4Description: Compel; ComponentLink5Description: Chip-Dip; ComponentLink6Description: Belchip; Package_BOM: TSOP-6; Package Description: TSOP-6; SMD mounting: True; ComponentLink1Description: Supplier; ComponentLink1URL: http://www.compel.ru; ComponentLink2Description: Manufacturer Link; ComponentLink2URL: http://www.onsemi.ru.com/; Type: DD
DD3 = CP2102_Silicon Labs: DD CP2102 SINGLE-CHIP USB-TO-UART BRIDGE; ValueBOM: Микросхема  CP2102; Автор: Касперович Андрей; Количество1: 1; Цена1: 3.2; Количество2: 10000; Цена2: 2.95; Разрешен к применению: True; Package_BOM: QFN28; Type_BOM: Микросхема; HelpURL: https://www.silabs.com/documents/public/data-sheets/CP2102-9.pdf; PartNumber: CP2102_Silicon Labs; ManufacturerPartNumber: CP2102; Manufacturer: Silicon Labs; Value: CP2102; ComponentLink3Description: Datasheet; Modify: 20.11.2018 8:18:00; Supplier: Compel; Package: QFN50P500X500X90_HS-29N; ВП: Микросхема  CP2102; ComponentLink4URL: https://sds.compel.ru/search?q=CP2102; ComponentLink5URL: https://www.chipdip.by/search?searchtext=CP2102; ComponentLink6URL: https://belchip.by/search_fuzzy/?query=CP2102; ComponentLink4Description: Compel; ComponentLink5Description: Chip-Dip; ComponentLink6Description: Belchip; Package Description: QFN50P500X500X90_HS-29N; SMD mounting: True; ComponentLink1Description: Supplier; ComponentLink1URL: http://www.compel.ru; ComponentLink2Description: Manufacturer Link; ComponentLink2URL: http://www.silabs.com/; Type: DD
R19 R20 = RC0402FR-075K1L_Yageo: RES 5k1 SMD 0402 1%; Manufacturer: Yageo; Power: 0,1 Вт; ValueBOM: Резистор RC0402FR-075K1L "Yageo" (5,1 кОм ± 1 %, 0,1 Вт SMD 0402); ТКС: ±100ppm/C°; Автор: Анципов Антон; Количество1: 1; Цена1: 0,0011; Количество2: 50000; Цена2: 0,0010; Разрешен к применению: True; Type_BOM: Резистор; PartNumber: RC0402FR-075K1L_Yageo; HelpURL: http://www.yageo.com/documents/recent/PYu-RC0402_51_RoHS_L_6.pdf; ManufacturerPartNumber: RC0402FR-075K1L; ComponentLink3Description: Datasheet; Value: 5,1к; Tolerance: ± 1 %; ComponentLink2Description: Manufacturer Link; ComponentLink2URL: http://www.yageo.com/; Operating Temperature: -55°C ~ +155°C; Modify: 09.02.2021 18:51:35; Supplier: Compel; Supplier P/N: RC0402FR-075K1L; Package Description: SMD 0402; Package: RESC0402; Type: R; ComponentLink4URL: https://sds.compel.ru/search?q=RC0402FR-075K1L; ComponentLink5URL: https://www.chipdip.by/search?searchtext=RC0402FR-075K1L; ComponentLink6URL: https://belchip.by/search_fuzzy/?query=RC0402FR-075K1L; ComponentLink4Description: Compel; ComponentLink5Description: Chip-Dip; ComponentLink6Description: Belchip; Package_BOM: SMD 0402
R21 = CMP-RES-SMD-0429-2: RES SMD 4,7 KOHM 1% 1/10W 0603; Manufacturer: Yageo; Max Power Dissipation: 100mW; Temperature Coefficient: ±100ppm/C°; Voltage Rating: 75V; Author: M.S. Koval; Case/Package: 0603; HelpURL: https://www.yageo.com/upload/media/product/productsearch/datasheet/rchip/PYu-RC_Group_51_RoHS_L_11.pdf; Manufacturer Part Number: RC0603FR-074K7L; Max Operating Temperature: 155°C; Min Operating Temperature: -55°C; Tolerance: 1%
R22 R23 = CMP-RES-SMD-0389-2: RES SMD 100 OHM 1% 1/10W 0603; Manufacturer: Yageo; Max Power Dissipation: 100mW; Temperature Coefficient: ±100ppm/C°; Voltage Rating: 75V; Author: M.S. Koval; Case/Package: 0603; HelpURL: https://www.yageo.com/upload/media/product/productsearch/datasheet/rchip/PYu-RC_Group_51_RoHS_L_11.pdf; Manufacturer Part Number: RC0603FR-07100RL; Max Operating Temperature: 155°C; Min Operating Temperature: -55°C; Tolerance: 1%
VD5 = BAT20JFILM_STMicroelectronics: DIODE SCHOTTKY 23V 1A; Voltage: 23 В; Current: 1 А; ValueBOM: Диод BAT20JFILM "STMicroelectronics" SOD-323; Marking: 20; Автор: Селедцов Михаил; Количество1: 1; Цена1: 0.32; Количество2: 1000; Цена2: 0.0612; Разрешен к применению: True; ВП: Диод BAT20JFILM SOD-323; Type: VD; Type_BOM: Диод; HelpURL: https://www.st.com/resource/en/datasheet/bat20j.pdf; PartNumber: BAT20JFILM_STMicroelectronics; ManufacturerPartNumber: BAT20JFILM; Manufacturer: STMicroelectronics; Value: BAT20JFILM; Operating Temperature: -65°C ~ +150°C; ComponentLink3Description: Datasheet; Modify: 26.03.2020 17:26:51; Supplier: Digi-Key; Supplier P/N: 497-3381-1-ND; Package: SOD-323; ComponentLink4URL: https://www.digikey.com/product-detail/en/stmicroelectronics/BAT20JFILM/497-3381-1-ND/669138; ComponentLink5URL: https://www.chipdip.by/search?searchtext=STPS0560Z; ComponentLink6URL: https://sds.compel.ru/infosheet/ST/BAT20JFILM; ComponentLink4Description: Digi-Key; ComponentLink5Description: Chip-Dip; ComponentLink6Description: Compel; Package_BOM: SOD-323; Package Description: SOD-323; SMD mounting: True; ComponentLink1Description: Supplier; ComponentLink1URL: http://www.digikey.com; ComponentLink2Description: Manufacturer Link; ComponentLink2URL: http://www.st.com
XS4 = CMP-CON-USB-0008-1: USB3.1 TYPEC 16P SMD RA; Manufacturer: JAE; Gender: Female; Current Rating: 5A; USB Standard: USB 3.2; Number of Ports: 1; USB Type: Type-C; Mating Cycles: 10000; Height: 1.57mm; Author: V.O.Ivanchenko; HelpURL: https://www.jae.com/en/connectors/series/detail/product/id=66509; Orientation: Horizontal; Min Operating Temperature: -40°C; Manufacturer Part Number: 16pf-015; Mount: Surface Mount; Max Operating Temperature: 85°C